# EAGLE design GROUP_09 (EAGLE 9.6.2)
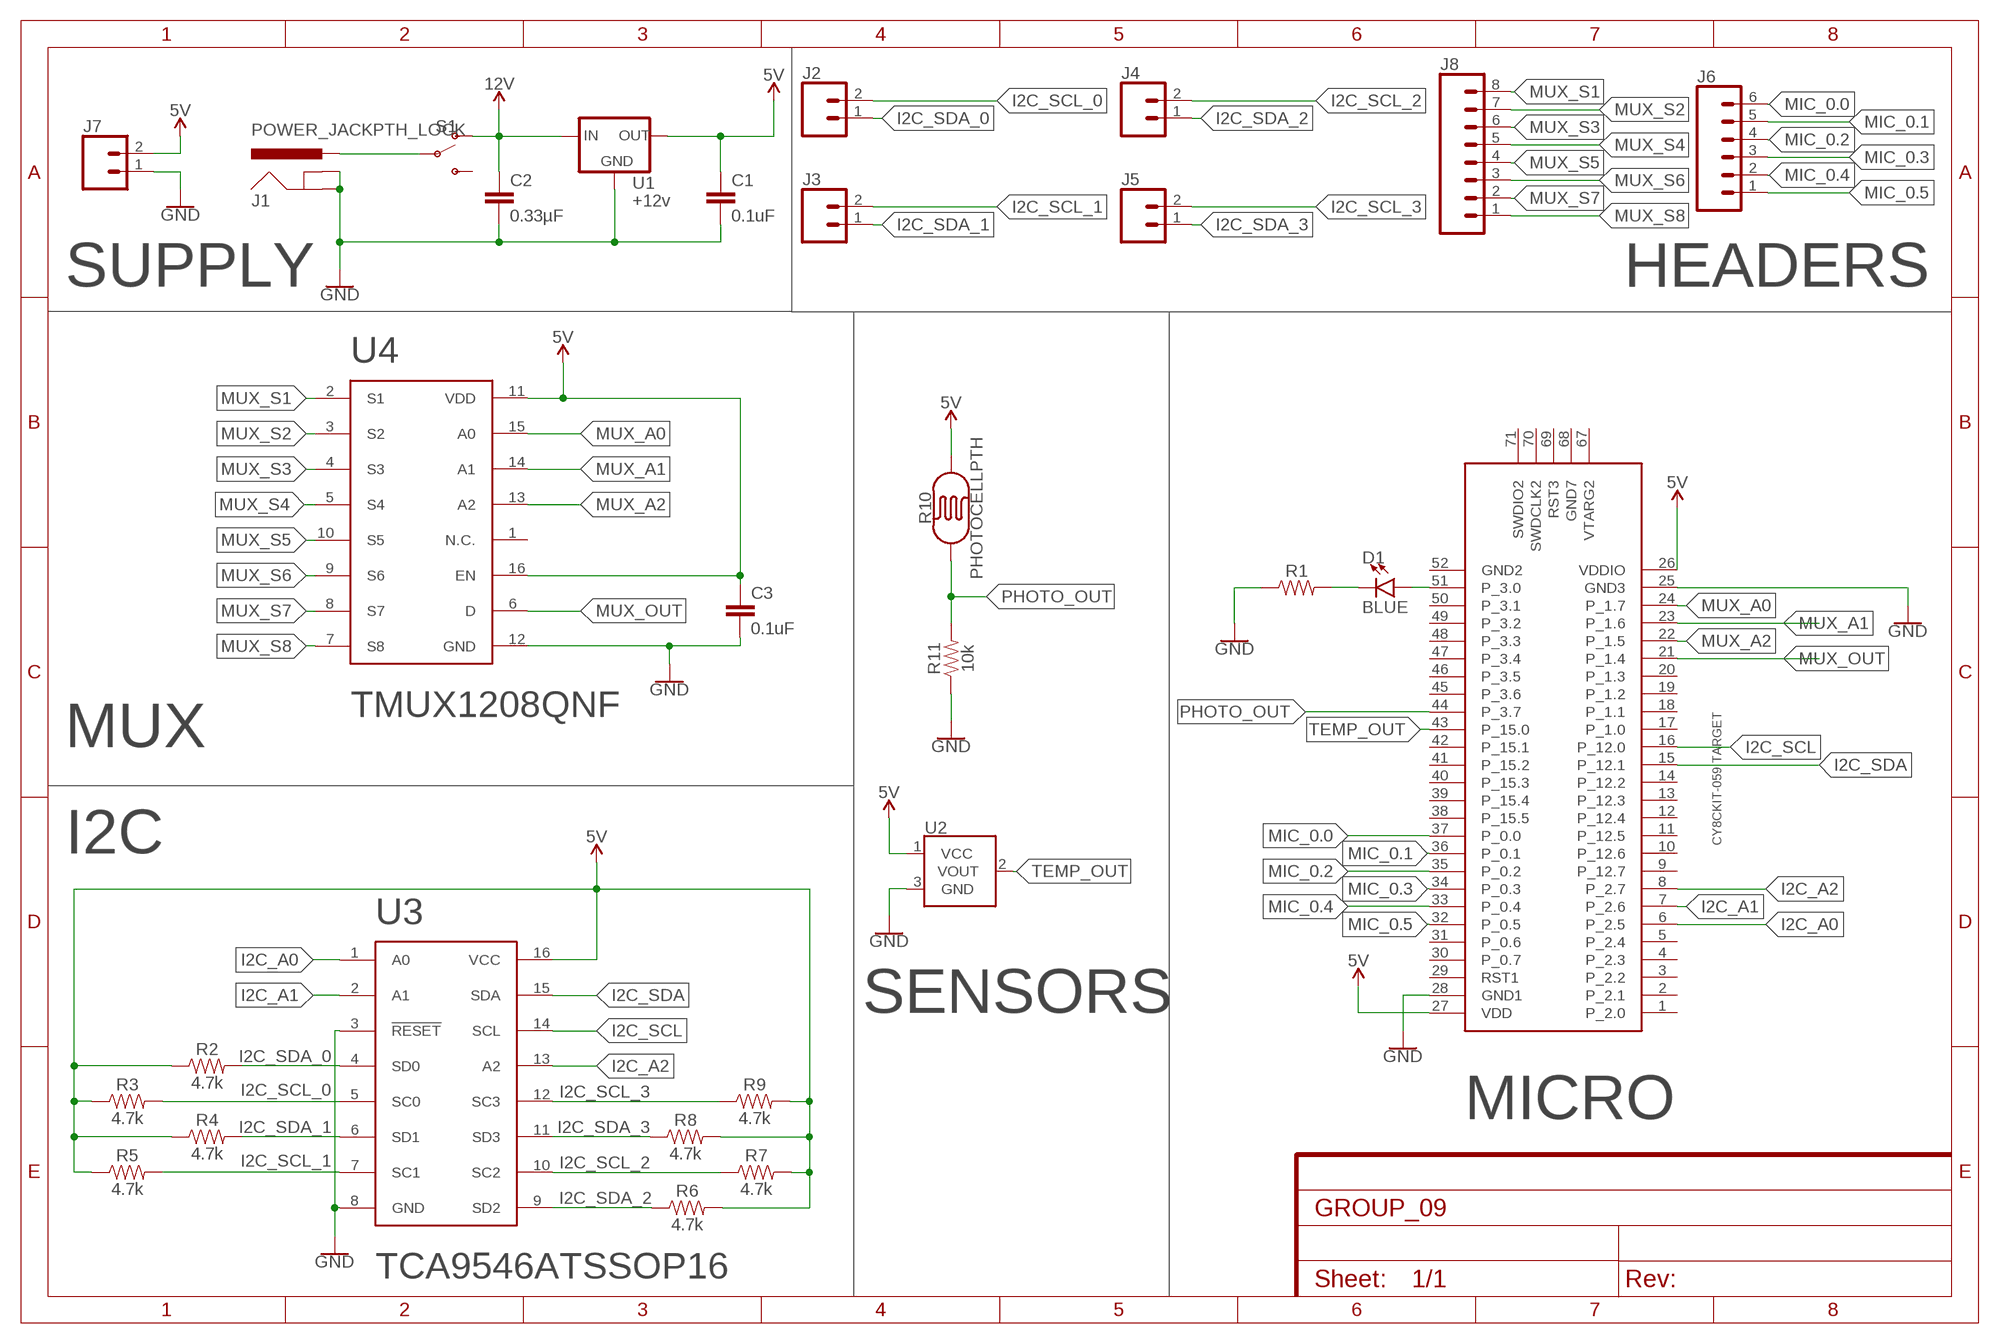
[diagram p0: schematic, sheet 1]

## Parts
C1  0.1uF  0.1UF-KIT-EZ-50V-20%  [CAP-PTH-SMALL-KIT]
C2  0.33µF  0.33UF/330NF-0805-50V-10%  [0805]
C3  0.1uF  0.1UF-KIT-EZ-50V-20%  [CAP-PTH-SMALL-KIT]
CY8CKIT059-TARGET  CY8CKIT-059_TARGET  [CY8CKIT-059_TARGET]
D1  BLUE  LED-BLUE1206  [LED-1206]
J1  POWER_JACKPTH_LOCK  [POWER_JACK_PTH_LOCK]
J2  CONN_02  [1X02]
J3  CONN_02  [1X02]
J4  CONN_02  [1X02]
J5  CONN_02  [1X02]
J6  CONN_06LOCK  [1X06_LOCK]
J7  CONN_02  [1X02]
J8  CONN_08LOCK  [1X08_LOCK]
R1  RESISTORAXIAL-0.3  [AXIAL-0.3]
R2  4.7k  4.7KOHM-0603-1/10W-1%  [0603]
R3  4.7k  4.7KOHM-0603-1/10W-1%  [0603]
R4  4.7k  4.7KOHM-0603-1/10W-1%  [0603]
R5  4.7k  4.7KOHM-0603-1/10W-1%  [0603]
R6  4.7k  4.7KOHM-0603-1/10W-1%  [0603]
R7  4.7k  4.7KOHM-0603-1/10W-1%  [0603]
R8  4.7k  4.7KOHM-0603-1/10W-1%  [0603]
R9  4.7k  4.7KOHM-0603-1/10W-1%  [0603]
R10  PHOTOCELLPTH  [PHOTOCELL]
R11  10k  10KOHM-0603-1/10W-1%  [0603]
S1  SWITCH-SPDT-PTH-11.6X4.0MM  [SWITCH_SPDT_PTH_11.6X4.0MM]
U1  +12v  V_REG_78XX7812  [TO-252]
U2  TMP36GT9  [TO-92]
U3  TCA9546ATSSOP16  [TSSOP-16]
U4  TMUX1208QNF  [QFN-16]

## Nets
5V: C1.1 C3.1 CY8CKIT059-TARGET.26(VDDIO) CY8CKIT059-TARGET.27(VDD) J7.2 R2.1 R3.1 R4.1 R5.1 R6.2 R7.2 R8.2 R9.2 R10.2 U1.2(OUT) U2.1(VCC) U3.16(VCC) U4.11(VDD) U4.16(EN)
12V: C2.1 S1.1(O) U1.1(IN)
GND: C1.2 C2.2 C3.2 CY8CKIT059-TARGET.25(GND3) CY8CKIT059-TARGET.28(GND1) J1.GND J1.GNDBREAK J7.1 R1.P$1 R11.1 U1.3(GND) U2.3(GND) U3.3(!RESET!) U3.8(GND) U4.12(GND)
I2C_A0: CY8CKIT059-TARGET.6(P_2.5) U3.1(A0)
I2C_A1: CY8CKIT059-TARGET.7(P_2.6) U3.2(A1)
I2C_A2: CY8CKIT059-TARGET.8(P_2.7) U3.13(A2)
I2C_SCL: CY8CKIT059-TARGET.16(P_12.0) U3.14(SCL)
I2C_SCL_0: J2.2 R3.2 U3.5(SC0)
I2C_SCL_1: J3.2 R5.2 U3.7(SC1)
I2C_SCL_2: J4.2 R7.1 U3.10(SC2)
I2C_SCL_3: J5.2 R9.1 U3.12(SC3)
I2C_SDA: CY8CKIT059-TARGET.15(P_12.1) U3.15(SDA)
I2C_SDA_0: J2.1 R2.2 U3.4(SD0)
I2C_SDA_1: J3.1 R4.2 U3.6(SD1)
I2C_SDA_2: J4.1 R6.1 U3.9(SD2)
I2C_SDA_3: J5.1 R8.1 U3.11(SD3)
MIC_0.0: CY8CKIT059-TARGET.37(P_0.0) J6.6
MIC_0.1: CY8CKIT059-TARGET.36(P_0.1) J6.5
MIC_0.2: CY8CKIT059-TARGET.35(P_0.2) J6.4
MIC_0.3: CY8CKIT059-TARGET.34(P_0.3) J6.3
MIC_0.4: CY8CKIT059-TARGET.33(P_0.4) J6.2
MIC_0.5: CY8CKIT059-TARGET.32(P_0.5) J6.1
MUX_A0: CY8CKIT059-TARGET.24(P_1.7) U4.15(A0)
MUX_A1: CY8CKIT059-TARGET.23(P_1.6) U4.14(A1)
MUX_A2: CY8CKIT059-TARGET.22(P_1.5) U4.13(A2)
MUX_OUT: CY8CKIT059-TARGET.21(P_1.4) U4.6(D)
MUX_S1: J8.8 U4.2(S1)
MUX_S2: J8.7 U4.3(S2)
MUX_S3: J8.6 U4.4(S3)
MUX_S4: J8.5 U4.5(S4)
MUX_S5: J8.4 U4.10(S5)
MUX_S6: J8.3 U4.9(S6)
MUX_S7: J8.2 U4.8(S7)
MUX_S8: J8.1 U4.7(S8)
N$2: J1.PWR S1.2(P)
N$6: CY8CKIT059-TARGET.51(P_3.0) D1.A
N$11: D1.C R1.P$2
PHOTO_OUT: CY8CKIT059-TARGET.44(P_3.7) R10.1 R11.2
TEMP_OUT: CY8CKIT059-TARGET.43(P_15.0) U2.2(VOUT)
Unconnected: CY8CKIT059-TARGET.1(P_2.0) CY8CKIT059-TARGET.2(P_2.1) CY8CKIT059-TARGET.3(P_2.2) CY8CKIT059-TARGET.4(P_2.3) CY8CKIT059-TARGET.5(P_2.4) CY8CKIT059-TARGET.9(P_12.7) CY8CKIT059-TARGET.10(P_12.6) CY8CKIT059-TARGET.11(P_12.5) CY8CKIT059-TARGET.12(P_12.4) CY8CKIT059-TARGET.13(P_12.3) CY8CKIT059-TARGET.14(P_12.2) CY8CKIT059-TARGET.17(P_1.0) CY8CKIT059-TARGET.18(P_1.1) CY8CKIT059-TARGET.19(P_1.2) CY8CKIT059-TARGET.20(P_1.3) CY8CKIT059-TARGET.29(RST1) CY8CKIT059-TARGET.30(P_0.7) CY8CKIT059-TARGET.31(P_0.6) CY8CKIT059-TARGET.38(P_15.5) CY8CKIT059-TARGET.39(P_15.4) CY8CKIT059-TARGET.40(P_15.3) CY8CKIT059-TARGET.41(P_15.2) CY8CKIT059-TARGET.42(P_15.1) CY8CKIT059-TARGET.45(P_3.6) CY8CKIT059-TARGET.46(P_3.5) CY8CKIT059-TARGET.47(P_3.4) CY8CKIT059-TARGET.48(P_3.3) CY8CKIT059-TARGET.49(P_3.2) CY8CKIT059-TARGET.50(P_3.1) CY8CKIT059-TARGET.52(GND2) CY8CKIT059-TARGET.67(VTARG2) CY8CKIT059-TARGET.68(GND7) CY8CKIT059-TARGET.69(RST3) CY8CKIT059-TARGET.70(SWDCLK2) CY8CKIT059-TARGET.71(SWDIO2) S1.3(S) U4.1(N.C.)

## Notes on the sheet
- SUPPLY | HEADERS
- MUX
- I2C
- SENSORS
- MICRO

## Library data of the parts
C1 C3 = SparkFun-Capacitors:0.1UF: 0.1µF ceramic capacitors A capacitor is a passive two-terminal electrical component used to store electrical energy temporarily in an electric field.; PROD_ID: CAP-08370
C2 = SparkFun-Capacitors:0.33UF/330NF: 0.33µF/330nF ceramic capacitors A capacitor is a passive two-terminal electrical component used to store electrical energy temporarily in an electric field.; PROD_ID: CAP-08469
CY8CKIT059-TARGET = CY8KIT-059:CY8CKIT-059_TARGET: CY8CKIT-059 Target This device exposes the pins of the target section of the CY8CKIT-059, including the programming section, that must be connected to the KitProg in order to program the target micro-controller.
D1 = SparkFun-LED:LED-BLUE: Blue SMD LED Used in manufacturing of various products at SparkFun Packages: 0603 - SMD 0603 package [Product Link] <http://www.digikey.com/product-detail/en/SMLE12BC7TT86/511-1589-2-ND/1641808> 1206 - SMD1206 package [Product Link] <http://www.digikey.com/product-detail/en/lite-on-inc/LTST-C150TBKT/160-1643-1-ND/573584> SparkFun Products: ESP8266 Thing-Dev Board <https://www.sparkfun.com/products/13711> RedBoard <https://www.sparkfun.com/products/12757>; PROD_ID: DIO-09911
J1 = SparkFun-Connectors:POWER_JACK: Power Jack Connector This is the standard 5.5mm barrel jack for power. The PTH is the most common, proven, reliable, footprint. The Slot footprint only works if the mill layer is transmitted to the PCB fab house so be warned. Here are the connectors we sell at SparkFun: DC Barrel Power Jack/Connector <https://www.sparkfun.com/products/119> (PRT-00119) DC Barrel Power Jack/Connector (SMD) <https://www.sparkfun.com/products/12748> (PRT-12748) DC Barrel Jack Adapter - Breadboard Compatible <https://www.sparkfun.com/products/10811> (PRT-10811) It is used on this SparkFun product (and many, many others): SparkFun RedBoard - Programmed with Arduino <https://www.sparkfun.com/products/12757> (DEV-12757) Also, if you need a mating power supply or connector, please check these out: Wall Adapter Power Supply - 9VDC 650mA <https://www.sparkfun.com/products/298> (TOL-00298) DC Barrel Jack Adapter - Male <https://www.sparkfun.com/products/10287> (PRT-10287); PROD_ID: CONN-08197; SF_ID: PRT-00119
J2-J5 J7 = SparkFun-Connectors:CONN_02: Multi connection point. Often used as Generic Header-pin footprint for 0.1 inch spaced/style header connections On any of the 0.1 inch spaced packages, you can populate with these: Break Away Headers - Straight <https://www.sparkfun.com/products/116> (PRT-00116) Break Away Male Headers - Right Angle <https://www.sparkfun.com/products/553> (PRT-00553) Female Headers <https://www.sparkfun.com/products/115> (PRT-00115) Break Away Headers - Machine Pin <https://www.sparkfun.com/products/117> (PRT-00117) Break Away Female Headers - Swiss Machine Pin <https://www.sparkfun.com/products/743> (PRT-00743) For SCREWTERMINALS and SPRING TERMINALS visit here: Screw Terimnals on SparkFun.com <https://www.sparkfun.com/search/results?term=Screw+Terminals> (5mm/3.5mm/2.54mm spacing) This device is also useful as a general connection point to wire up your design to another part of your project. Our various solder wires solder well into these plated through hole pads. Hook-Up Wire - Assortment (Stranded, 22 AWG) <https://www.sparkfun.com/products/11375> (PRT-11375) Hook-Up Wire - Assortment (Solid Core, 22 AWG) <https://www.sparkfun.com/products/11367> (PRT-11367) View the entire wire category on our website here <https://www.sparkfun.com/categories/141> Special notes: Molex polarized connector foot print use with: PRT-08233 with associated crimp pins and housings. 2.54_SCREWTERM for use with PRT-10571. 3.5mm Screw Terminal footprints for PRT-08084 5mm Screw Terminal footprints for use with PRT-08432
J6 = SparkFun-Connectors:CONN_06: Multi connection point. Often used as Generic Header-pin footprint for 0.1 inch spaced/style header connections On any of the 0.1 inch spaced packages, you can populate with these: Break Away Headers - Straight <https://www.sparkfun.com/products/116> (PRT-00116) Break Away Male Headers - Right Angle <https://www.sparkfun.com/products/553> (PRT-00553) Female Headers <https://www.sparkfun.com/products/115> (PRT-00115) Break Away Headers - Machine Pin <https://www.sparkfun.com/products/117> (PRT-00117) Break Away Female Headers - Swiss Machine Pin <https://www.sparkfun.com/products/743> (PRT-00743) Arduino Stackable Header - 6 Pin <https://www.sparkfun.com/products/9280> (PRT-09280) For SCREWTERMINALS and SPRING TERMINALS visit here: Screw Terimnals on SparkFun.com <https://www.sparkfun.com/search/results?term=Screw+Terminals> (5mm/3.5mm/2.54mm spacing) This device is also useful as a general connection point to wire up your design to another part of your project. Our various solder wires solder well into these plated through hole pads. Hook-Up Wire - Assortment (Stranded, 22 AWG) <https://www.sparkfun.com/products/11375> (PRT-11375) Hook-Up Wire - Assortment (Solid Core, 22 AWG) <https://www.sparkfun.com/products/11367> (PRT-11367) View the entire wire category on our website here <https://www.sparkfun.com/categories/141>
J8 = SparkFun-Connectors:CONN_08: Multi connection point. Often used as Generic Header-pin footprint for 0.1 inch spaced/style header connections On any of the 0.1 inch spaced packages, you can populate with these: Break Away Headers - Straight <https://www.sparkfun.com/products/116> (PRT-00116) Break Away Male Headers - Right Angle <https://www.sparkfun.com/products/553> (PRT-00553) Female Headers <https://www.sparkfun.com/products/115> (PRT-00115) Break Away Headers - Machine Pin <https://www.sparkfun.com/products/117> (PRT-00117) Break Away Female Headers - Swiss Machine Pin <https://www.sparkfun.com/products/743> (PRT-00743) Arduino Stackable Header - 8 Pin <https://www.sparkfun.com/products/9279> (PRT-09279) For SCREWTERMINALS and SPRING TERMINALS visit here: Screw Terimnals on SparkFun.com <https://www.sparkfun.com/search/results?term=Screw+Terminals> (5mm/3.5mm/2.54mm spacing) This device is also useful as a general connection point to wire up your design to another part of your project. Our various solder wires solder well into these plated through hole pads. Hook-Up Wire - Assortment (Stranded, 22 AWG) <https://www.sparkfun.com/products/11375> (PRT-11375) Hook-Up Wire - Assortment (Solid Core, 22 AWG) <https://www.sparkfun.com/products/11367> (PRT-11367) View the entire wire category on our website here <https://www.sparkfun.com/categories/141> Special notes: Molex polarized connector foot print use with SKU : PRT-08231 with associated crimp pins and housings. 1MM SMD Version SKU: PRT-10208 NOTES ON THE VARIANTS LOCK and LOCK_LONGPADS... This footprint was designed to help hold the alignment of a through-hole component (i.e. 6-pin header) while soldering it into place. You may notice that each hole has been shifted either up or down by 0.005 of an inch from it's more standard position (which is a perfectly straight line). This slight alteration caused the pins (the squares in the middle) to touch the edges of the holes. Because they are alternating, it causes a "brace" to hold the component in place. 0.005 has proven to be the perfect amount of "off-center" position when using our standard breakaway headers. Although looks a little odd when you look at the bare footprint, once you have a header in there, the alteration is very hard to notice. Also,if you push a header all the way into place, it is covered up entirely on the bottom side.
R1 = SparkFun-Resistors:RESISTOR: Generic Resistor Package
R2-R9 = SparkFun-Resistors:4.7KOHM: 4.7kΩ resistor A resistor is a passive two-terminal electrical component that implements electrical resistance as a circuit element. Resistors act to reduce current flow, and, at the same time, act to lower voltage levels within circuits. - Wikipedia; PROD_ID: RES-07857
R10 = SparkFun-Sensors:PHOTOCELL: Photocell (Photodetector, Photo Resistor, CdS) This is a very small light sensor. A photocell changes (also called a photodetector, photo resistor, CdS or photoconductive cell) resistance depending on the amount of light it is exposed to. These little sensors make great ambient light triggers (when light in the room turns on, do something). Datasheet <http://cdn.sparkfun.com/datasheets/Sensors/LightImaging/SEN-09088.pdf> SparkFun Products Mini Photocell <https://www.sparkfun.com/products/9088> (SEN-09088); PROD_ID: COMP-09129; SF_ID: SEN-09088
R11 = SparkFun-Resistors:10KOHM: 10kΩ resistor A resistor is a passive two-terminal electrical component that implements electrical resistance as a circuit element. Resistors act to reduce current flow, and, at the same time, act to lower voltage levels within circuits. - Wikipedia; PROD_ID: RES-00824
S1 = SparkFun-Switches:SWITCH-SPDT: Single Pole, Double Throw (SPDT) Switch Single-pole, double-throw (SPDT) switch. Variant Overview SMD-AYZ0202 Surface Mount DPDT Switch <https://www.sparkfun.com/products/597> (COM-00597) Used on e.g. LilyPad Arduino USB - ATmega32U4 Board <https://www.sparkfun.com/products/12049> PTH-11.6X4.0MM SPDT Mini Power Switch <https://www.sparkfun.com/products/102> (COM-00102) Used on e.g. SparkFun Simon Says - Through-Hole Soldering Kit <https://www.sparkfun.com/products/10547> (KIT-10547) PTH-11.6X4.0MM-KIT KIT version of SPDT Mini Power Switch - Simplifies soldering by removing tStop of switch pins - only one side can be soldered. PTH-11.6X4.0MM-LOCK LOCK version of SPDT Mini Power Switch - Offset pins hold switch in place for easier soldering. SMD-RIGHT-ANGLE Surface Mount Right Angle Switch <https://www.sparkfun.com/products/10860> (COM-10860) Used on e.g. SparkFun ESP8266 Thing <https://www.sparkfun.com/products/13231>; PROD_ID: SWCH-08261; SF_SKU: COM-00102
U1 = SparkFun-IC-Power:V_REG_78XX: Voltage Regulator Standard 78xx regulator. IGO (Input Ground Output). Spark Fun Electronics SKU : COM-00107; PROD_ID: VREG-12370
U2 = SparkFun-Sensors:TMP36: TMP36 Precision Analog °C Temperature Sensor The TMP36 is a low voltage, precision centigrade temperature sensor. It provides a voltage output that is linearly proportional to the Celsius temperature. It also doesn’t require any external calibration to provide typical accuracies of ±1°C at +25°C and ±2°C over the −40°C to +125°C temperature range. We like it because it’s so easy to use: Just give the device a ground and 2.7 to 5.5 VDC and read the voltage on the Vout pin. The output voltage can be converted to temperature easily using the scale factor of 10 mV/°C. Datasheet <http://cdn.sparkfun.com/datasheets/Sensors/Temp/TMP35_36_37.pdf> SparkFun Products Temperature Sensor - TMP36 <https://www.sparkfun.com/products/10988> (SEN-10988) SparkFun Danger Shield <https://www.sparkfun.com/products/11649> (DEV-11649); PROD_ID: IC-09880; SF_ID: SEN-10988
U3 = Group_09_Library:TCA9546A: TCA9546A The TCA9546A is a quad bidirectional translating switch controlled via the I2C bus. The SCL/SDA upstream pair fans out to four downstream pairs, or channels. Any individual SCn/SDn channel or combination of channels can be selected, determined by the contents of the programmable control register. An active-low reset (RESET) input allows the TCA9546A to recover from a situation in which one of the downstream I2C buses is stuck in a low state. Pulling RESET low resets the I2C state machine and causes all the channels to be deselected, as does the internal power-on reset function. Available packages: TCA9546A
U4 = Group_09_Library:TMUX1208: TMUX1208 The TMUX1208 is a general purpose complementary metal-oxide semiconductor (CMOS) multiplexer (MUX). The TMUX1208 offers 8:1 single ended channels. Wide operating supply of 1.08 V to 5.5 V allows for use in a broad array of applications from personal electronics to building automation applications. The device supports bidirectional analog and digital signals on the source (Sx) and drain (D) pins ranging from GND to VDD. All logic inputs have 1.8 V logic compatible thresholds, ensuring both TTL and CMOS logic compatibility when operating in the valid supply voltage range. Fail-Safe Logic circuitry allows voltages on the control pins to be applied before the supply pin, protecting the device from potential damage. Available packages: QFN(16)

## Board
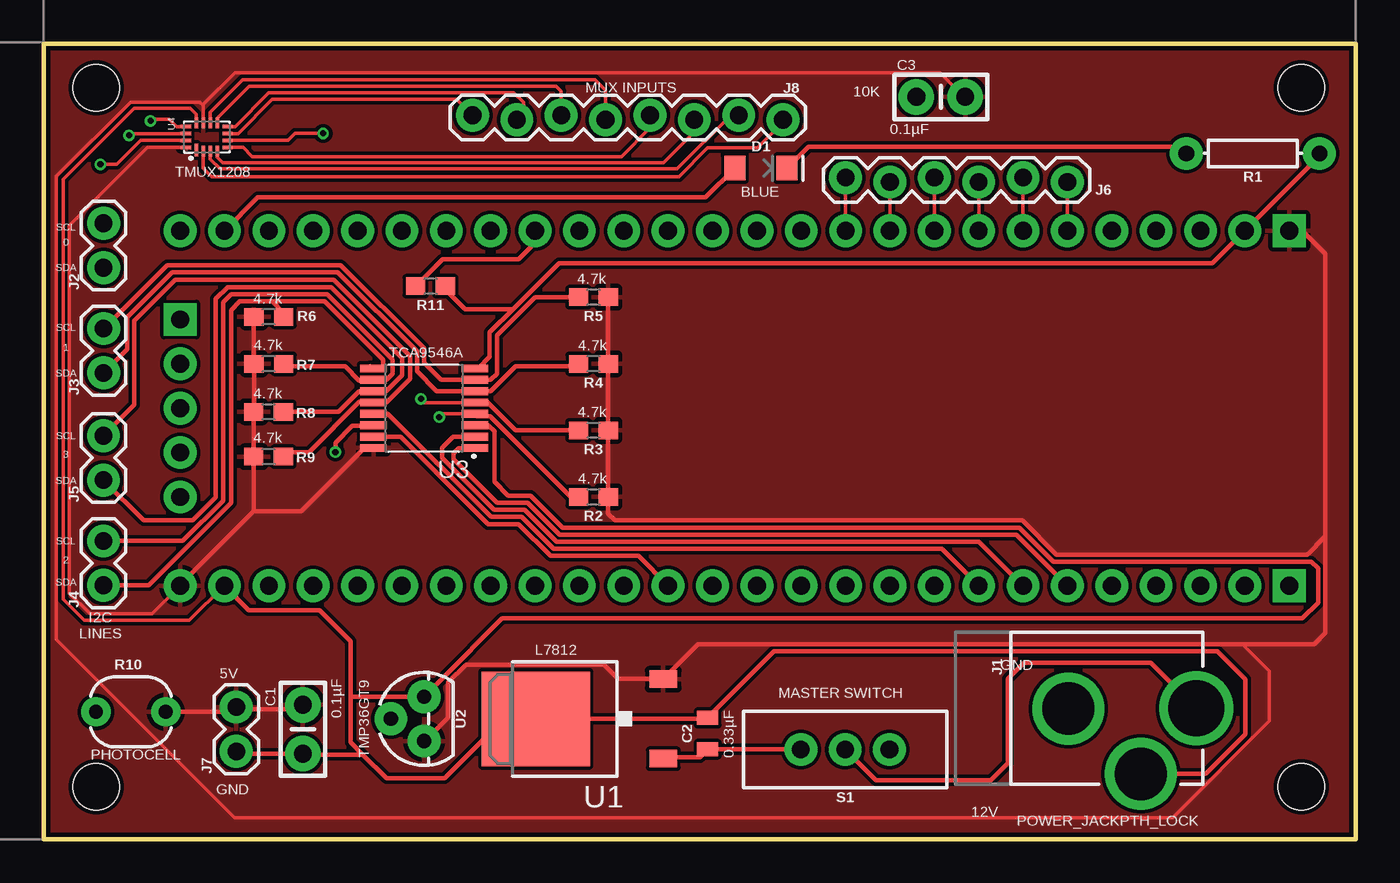
[diagram p1: board, top side]
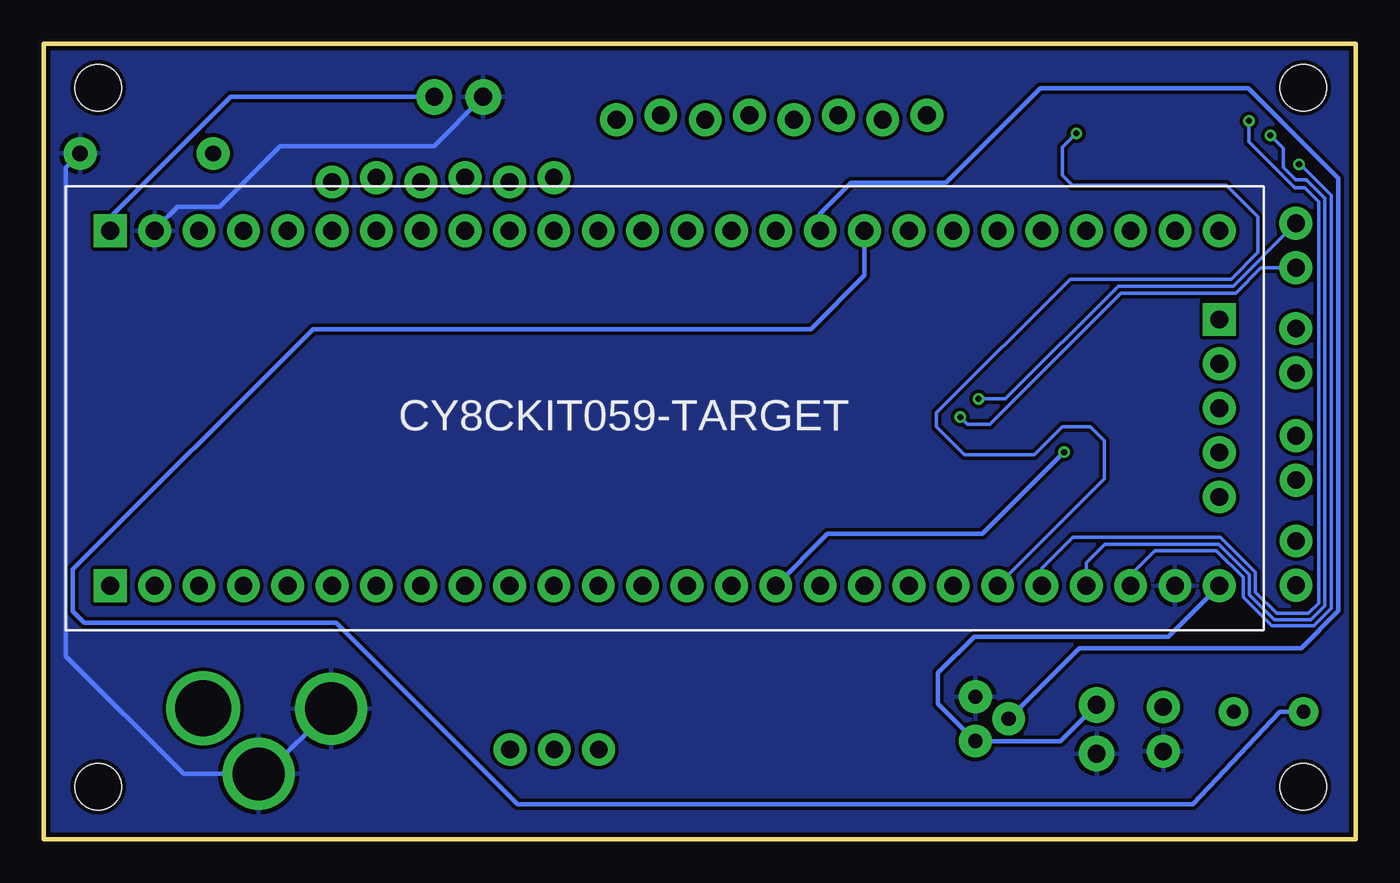
[diagram p2: board, bottom side, seen from below]

Size 75.12 x 45.53 mm. Coordinates in mm from the lower left corner, seen from the top.
Outline: 0,0 75.12,0 75.12,45.53 0,45.53 0,0
Copper layers (1*16): Top 0.035mm / dielectric 1.5mm / Bottom 0.035mm
Design rules "default *": minimum track width 6mil, minimum drill 8mil, track to track 6mil, track to pad 6mil, pad to pad 6mil, via to via 6mil, smd to smd 6mil, copper to edge 10mil, drill to drill 6mil, minimum pad ring 8mil, minimum via ring 6mil, stop-mask expansion 8mil, vias tented up to drill 0mil, thermal gap 10mil
Holes 2.65 mm at 3,43 3,3 72,43 72,3

### Footprints (pad centres in the part's own frame; a part is rotated, then mirrored left to right if it is on the bottom)
CAP-PTH-SMALL-KIT = drill 1.016 pad 2.032: 1 -1.397,0; 2 1.397,0
0805 = smd 0.8 x 1.2: 1 -0.9,0; 2 0.9,0
CY8CKIT-059_TARGET = drill 1.016 pad 1.876 square: 1 30.48,8.89; 27 30.48,-11.43; 71 -33.02,-6.35 | drill 1.016 pad 1.876: 2 27.94,8.89; 3 25.4,8.89; 4 22.86,8.89; 5 20.32,8.89; 6 17.78,8.89; 7 15.24,8.89; 8 12.7,8.89; 9 10.16,8.89; 10 7.62,8.89; 11 5.08,8.89; 12 2.54,8.89; 13 0,8.89; 14 -2.54,8.89; 15 -5.08,8.89; 16 -7.62,8.89; 17 -10.16,8.89; 18 -12.7,8.89; 19 -15.24,8.89; 20 -17.78,8.89; 21 -20.32,8.89; 22 -22.86,8.89; 23 -25.4,8.89; 24 -27.94,8.89; 25 -30.48,8.89; 26 -33.02,8.89; 28 27.94,-11.43; 29 25.4,-11.43; 30 22.86,-11.43; 31 20.32,-11.43; 32 17.78,-11.43; 33 15.24,-11.43; 34 12.7,-11.43; 35 10.16,-11.43; 36 7.62,-11.43; 37 5.08,-11.43; 38 2.54,-11.43; 39 0,-11.43; 40 -2.54,-11.43; 41 -5.08,-11.43; 42 -7.62,-11.43; 43 -10.16,-11.43; 44 -12.7,-11.43; 45 -15.24,-11.43; 46 -17.78,-11.43; 47 -20.32,-11.43; 48 -22.86,-11.43; 49 -25.4,-11.43; 50 -27.94,-11.43; 51 -30.48,-11.43; 52 -33.02,-11.43; 67 -33.02,3.81; 68 -33.02,1.27; 69 -33.02,-1.27; 70 -33.02,-3.81
LED-1206 = smd 1.2 x 1.4: A -1.5,0; C 1.5,0
POWER_JACK_PTH_LOCK = drill 2.997 pad 4.115: GND 0.025,6.557; GNDBREAK 3.762,10.7 | drill 3.2 pad 4.115: PWR 0,13.878
1X02 = drill 1.016 pad 1.88: 1 0,0; 2 2.54,0
1X06_LOCK = drill 1.016 pad 1.88: 1 0,0; 2 2.54,-0.254; 3 5.08,0; 4 7.62,-0.254; 5 10.16,0; 6 12.7,-0.254
1X08_LOCK = drill 1.016 pad 1.88: 1 0,0.127; 2 2.54,-0.127; 3 5.08,0.127; 4 7.62,-0.127; 5 10.16,0.127; 6 12.7,-0.127; 7 15.24,0.127; 8 17.78,-0.127
AXIAL-0.3 = drill 0.9 pad 1.88: P$1 -3.81,0; P$2 3.81,0
0603 = smd 1.1 x 1: 1 -0.85,0; 2 0.85,0
PHOTOCELL = drill 0.8 pad 1.676: 1 -2,0; 2 2,0
SWITCH_SPDT_PTH_11.6X4.0MM = drill 1.016 pad 1.88: 1 0,2.54; 2 0,0; 3 0,-2.54
TO-252 = smd 1 x 1.6: 1 -2.28,-4.8; 2 2.28,-4.8 | smd 5.4 x 6.2: 3 0,2.5
TO-92 = drill 0.813 pad 1.88: 1 -1.27,0; 2 0,1.905; 3 1.27,0
TSSOP-16 = smd 1.5 x 0.45: 1 -2.9,2.275; 2 -2.9,1.625; 3 -2.9,0.975; 4 -2.9,0.325; 5 -2.9,-0.325; 6 -2.9,-0.975; 7 -2.9,-1.625; 8 -2.9,-2.275; 9 2.9,-2.275; 10 2.9,-1.625; 11 2.9,-0.975; 12 2.9,-0.325; 13 2.9,0.325; 14 2.9,0.975; 15 2.9,1.625; 16 2.9,2.275
QFN-16 = smd 0.7 x 0.2: 1 -0.75,0.6 | smd 0.6 x 0.2: 2 -0.8,0.2; 3 -0.8,-0.2; 4 -0.8,-0.6; 9 0.8,-0.6; 10 0.8,-0.2; 11 0.8,0.2; 12 0.8,0.6 | smd 0.2 x 0.6: 5 -0.6,-1.2; 6 -0.2,-1.2; 7 0.2,-1.2; 8 0.6,-1.2; 13 0.6,1.2; 14 0.2,1.2; 15 -0.2,1.2; 16 -0.6,1.2

### Placement (x,y rotation side)
C1  14.84,6.3 270 top
C2  38.01,6.05 90 top
C3  51.36,42.49 180 top
CY8CKIT059-TARGET  40.83,23.4 180 bottom
D1  41.07,38.41 0 top
J1  52.11,7.5 270 top
J2  3.43,32.71 90 top
J3  3.43,26.69 90 top
J4  3.42,14.53 90 top
J5  3.42,20.55 90 top
J6  58.61,37.61 180 top
J7  11.03,5.03 90 top
J8  24.55,41.31 0 top
R1  69.23,39.25 180 top
R2  31.47,19.59 180 top
R3  31.47,23.4 180 top
R4  31.47,27.21 180 top
R5  31.47,31.02 180 top
R6  12.89,29.9 180 top
R7  12.89,27.21 180 top
R8  12.87,24.46 180 top
R9  12.87,21.9 180 top
R10  4.99,7.29 0 top
R11  22.14,31.65 180 top
S1  45.88,5.14 90 top
U1  30.67,6.89 90 top
U2  21.78,6.89 90 top
U3  21.78,24.67 180 top
U4  9.33,40.19 90 top

### Tracks (layer width: path | path; a pad name or v marks a point on that pad's centre or on a via)
5V
  Top 0.203: CY8CKIT059-TARGET.26 6.2,12.9 2.67,12.9 1.48,14.09 1.48,35.1 5.96,39.59 U4.16 | U4.11 9.13,42 | 9.13,42 9.13,42.05 10.95,43.87 51.3,43.87 52.69,42.49 C3.1 | 9.13,42 8.95,42.19 4.99,42.19 0.73,37.93 0.73,11.46 10.95,1.24 64.63,1.24 70.17,6.77 70.17,9.62 68.63,11.16 62.8,11.16
  Top 0.254: U2.1 21.93,5.72 23.15,6.94 23.15,8.97 24.17,9.99 32.08,9.99 32.89,9.18 35.34,9.18 U1.2 37.46,11.16 62.8,11.16 72.73,11.16 73.38,11.8 73.38,17.34 | 12.02,18.77 7.91,14.66 CY8CKIT059-TARGET.26 | CY8CKIT059-TARGET.27 72.05,34.83 73.38,33.5 73.38,17.34 | R6.2 R7.2 12.04,24.48 R8.2 12.16,24.46 12.02,24.32 R9.2 12.02,18.77 | 73.38,17.34 72.33,16.29 57.98,16.29 56.02,18.25 32.7,18.25 32.32,18.62 32.32,19.51 32.38,19.57 R2.1 R3.1 R4.1 R5.1 | 12.02,18.77 14.74,18.77 18.36,22.39 U3.16 | R10.2 10.76,7.29 10.89,7.43 | 10.89,7.43 J7.2 | C1.1 14.57,7.43 10.89,7.43
  Bottom 0.254: CY8CKIT059-TARGET.27 71.31,35.59 64.41,42.49 C3.1 | CY8CKIT059-TARGET.26 10.72,11.6 21.84,11.6 23.91,9.52 23.91,7.75 U2.1 16.91,5.62 C1.1
  pour Top (isolate 0.203): 0,45.6 75.2,45.6 75.2,0 0,0
12V
  Top 0.254: U1.1 35.55,4.71 37.56,4.71 C2.1 43.33,5.15 S1.1
GND
  Top 0.203: U4.12 8.73,41.5 8.4,41.83 5.17,41.83 1.11,37.77 1.11,13.75 2.32,12.53 8.34,12.53 10.32,14.51 CY8CKIT059-TARGET.25
  Top 0.254: CY8CKIT059-TARGET.25 11.75,13.11 15.79,13.11 17.56,11.34 17.56,8.16 | 17.56,8.16 17.56,5.54 18.27,4.84 | 17.56,8.16 U2.3 22.75,9.12 22.75,9.14 26.25,12.64 72.06,12.64 72.96,13.54 72.96,15.5 72.58,15.88 57.81,15.88 55.85,17.84 29.69,17.84 27.87,19.67 26.59,19.67 25.81,20.45 25.81,23.35 25.45,23.7 U3.3 | R1.P$1 73.04,39.1 CY8CKIT059-TARGET.28 66.92,32.98 29.51,32.98 26.87,30.33 | U3.8 24.88,26.95 25.54,27.6 25.54,29 26.87,30.33 | 18.27,4.84 19.62,3.49 22.95,3.49 26.2,6.74 28.03,6.74 U1.3 37.95,6.89 C2.2 41.81,10.76 67.2,10.76 68.8,9.16 68.8,6 66.54,3.74 J1.GNDBREAK | 26.87,30.33 24.13,30.33 22.99,31.47 R11.1 | J7.1 11.16,4.9 C1.2 14.9,4.84 18.27,4.84
  Bottom 0.254: CY8CKIT059-TARGET.28 68.67,34.98 67.45,36.2 65.04,36.2 61.57,39.67 52.78,39.67 C3.2 | R1.P$1 73.85,38.44 73.85,10.47 67.12,3.74 J1.GNDBREAK 62.4,3.74 J1.GND
  pour Bottom (isolate 0.203): 0,45.6 0,0 75.2,0 75.2,45.6
I2C_A0
  Top 0.254: 24.74,22.33 U3.1 24.67,22.38 23.76,22.38 23.46,22.08 23.46,21.75 25.95,19.26 27.7,19.26 29.53,17.43 55.69,17.43 CY8CKIT059-TARGET.6
I2C_A1
  Top 0.254: U3.2 23.45,23.05 22.8,22.4 22.8,21.83 25.78,18.85 27.53,18.85 29.36,17.03 53.55,17.03 CY8CKIT059-TARGET.7
I2C_A2
  Top 0.254: U3.13 19.7,24.35 25.61,18.45 27.36,18.45 29.19,16.62 51.42,16.62 CY8CKIT059-TARGET.8
I2C_SCL  (via drill 0.35)
  Top 0.254: U3.14 18.84,23.65 17.67,23.65 16.7,22.69 v16.7,22.16
  Bottom 0.254: v16.7,22.16 21.37,17.48 30.24,17.48 CY8CKIT059-TARGET.16
I2C_SCL_0  (via drill 0.35)
  Top 0.203: v21.6,25.2 21.8,25 U3.5
  Top 0.254: R3.2 27.01,23.4 25.39,25.03 24.78,25.03 U3.5
  Bottom 0.203: J2.2 7.02,31.66 13.6,31.66 20.05,25.2 v21.6,25.2
I2C_SCL_1
  Top 0.254: R5.2 28.13,31.02 25.95,28.84 25.95,26.65 25.59,26.3 U3.7 22.75,26.3 21.78,27.26 21.78,28.09 17.01,32.86 7.06,32.86 J3.2
I2C_SCL_2
  Top 0.254: R7.1 13.8,27.06 17.26,27.06 18.07,26.25 18.68,26.25 U3.10 19.62,26.3 19.98,26.66 19.98,27.45 16.24,31.19 10.74,31.19 10.28,30.73 10.28,19.38 7.96,17.07 J4.2
I2C_SCL_3
  Top 0.254: J5.2 5.19,24.86 5.19,29.69 7.52,32.02 16.61,32.02 20.97,27.66 20.97,26.36 19.6,25 U3.12 18.68,25.03 18.07,25.03 15.21,22.16 13.98,22.16 R9.1
I2C_SDA
  Top 0.254: 18.88,22.99 U3.15 20.43,23.05 25.44,18.04 27.19,18.04 29.02,16.21 34.05,16.21 CY8CKIT059-TARGET.15
I2C_SDA_0  (via drill 0.35)
  Top 0.203: v22.64,24.16 22.83,24.34 U3.4
  Top 0.254: 24.78,24.21 U3.4 24.83,24.2 25.55,24.2 30.16,19.59 R2.2
  Bottom 0.203: J2.1 5.43,32.71 6.88,31.25 13.46,31.25 20.96,23.76 22.24,23.76 v22.64,24.16
I2C_SDA_1
  Top 0.254: R4.2 30.45,27.06 27.01,27.06 25.59,25.64 24.78,25.64 U3.6 22.51,25.64 21.38,26.78 21.38,27.92 16.84,32.45 7.35,32.45 4.78,29.88 4.78,28.04 J3.1
I2C_SDA_2
  Top 0.254: U3.9 18.68,27.06 18.88,26.85 19.42,26.85 19.42,27.44 16.08,30.78 13.07,30.78 | 13.07,30.78 11.23,30.78 10.72,30.27 10.72,19.25 6,14.53 J4.1 | 13.07,30.78 13.73,30.11 R6.1
I2C_SDA_3
  Top 0.254: J5.1 5.73,18.24 8.53,18.24 9.86,19.57 9.86,30.93 10.53,31.6 16.45,31.6 20.51,27.54 20.51,26.55 19.6,25.64 U3.11 18.68,25.64 18.07,25.64 16.9,24.46 R8.1
MIC_0.0
  Top 0.203: J6.6 CY8CKIT059-TARGET.37
MIC_0.1
  Top 0.203: J6.5 CY8CKIT059-TARGET.36
MIC_0.2
  Top 0.203: J6.4 CY8CKIT059-TARGET.35
MIC_0.3
  Top 0.203: J6.3 CY8CKIT059-TARGET.34
MIC_0.4
  Top 0.203: J6.2 CY8CKIT059-TARGET.33
MIC_0.5
  Top 0.203: J6.1 CY8CKIT059-TARGET.32
MUX_A0  (via drill 0.35)
  Top 0.203: U4.15 5.56,39.99 4.19,38.63 v3.25,38.63
  Bottom 0.203: CY8CKIT059-TARGET.24 12.89,15.13 11.5,16.52 7.99,16.52 6.45,14.98 6.45,13.85 4.82,12.21 2.4,12.21 1.4,13.21 1.4,36.86 3.17,38.63 v3.25,38.63
MUX_A1  (via drill 0.35)
  Top 0.203: U4.14 5,40.39 v4.89,40.28
  Bottom 0.203: CY8CKIT059-TARGET.23 15.43,15.84 14.38,16.89 7.86,16.89 6.1,15.13 6.1,14 4.67,12.57 2.58,12.57 1.77,13.38 1.77,36.68 2.83,37.74 3.44,37.74 4.15,38.46 4.15,39.54 v4.89,40.28
MUX_A2  (via drill 0.35)
  Top 0.203: U4.13 7.61,40.79 7.2,41.2 6.21,41.2 v6.12,41.11
  Bottom 0.203: CY8CKIT059-TARGET.22 17.97,15.5 16.19,17.28 7.75,17.28 5.74,15.28 5.74,14.15 4.52,12.92 2.72,12.92 2.13,13.51 2.13,36.5 2.91,37.27 3.48,37.27 6.12,39.91 v6.12,41.11
MUX_OUT  (via drill 0.35)
  Top 0.203: U4.6 13.99,39.99 14.4,40.4 v16,40.4
  Bottom 0.203: v16,40.4 16.8,39.6 16.8,38 16.22,37.42 7.41,37.42 5.6,35.62 5.6,33.59 7.13,32.06 16.34,32.06 24,24.4 24,23.6 22.4,22 18.4,22 16.8,23.6 15.2,23.6 14.4,22.8 14.4,20.62 CY8CKIT059-TARGET.21
MUX_S1
  Top 0.203: U4.2 9.13,38.4 9.61,37.93 36.36,37.93 38.01,39.58 40.86,39.58 42.33,41.04 J8.8
MUX_S2
  Top 0.203: U4.3 9.53,38.92 10.1,38.36 36.27,38.36 39.34,41.43 J8.7
MUX_S3
  Top 0.203: U4.4 9.93,39.03 10.24,38.72 35.48,38.72 37.25,40.49 J8.6
MUX_S4
  Top 0.203: U4.5 11.42,39.59 11.94,39.07 33.07,39.07 34.71,40.71 J8.5
MUX_S5
  Top 0.203: U4.10 9.53,41.61 11.38,43.46 31.57,43.46 32.17,42.86 J8.4
MUX_S6
  Top 0.203: U4.9 9.93,41.26 11.76,43.09 29.34,43.09 29.63,42.8 J8.3
MUX_S7
  Top 0.203: J8.2 27.46,41.55 27.46,42.17 26.91,42.73 12.89,42.73 10.95,40.79 U4.8
MUX_S8
  Top 0.203: J8.1 23.63,42.35 13.08,42.35 11.12,40.39 U4.7
N$2
  Top 0.254: S1.2 47.64,3.38 54.23,3.38 55.2,4.35 55.2,9.2 56.12,10.12 63.37,10.12 J1.PWR
N$6
  Top 0.254: CY8CKIT059-TARGET.51 12.25,36.73 37.89,36.73 D1.A
N$11
  Top 0.254: R1.P$2 65.05,39.62 43.78,39.62 D1.C
PHOTO_OUT
  Top 0.254: CY8CKIT059-TARGET.44 28.13,34.13 27.2,33.2 22.84,33.2 R11.2
  Bottom 0.254: CY8CKIT059-TARGET.44 28.13,32.27 31.2,29.2 59.69,29.2 73.44,15.45 73.44,13.04 72.8,12.4 58.39,12.4 47.99,2 9.33,2 4.37,7.29 R10.1
TEMP_OUT
  Bottom 0.254: U2.2 15.82,10.94 3.12,10.94 1,13.07 1,37.82 6.16,42.97 18.06,42.97 23.46,37.57 28.89,37.57 30.67,35.8 CY8CKIT059-TARGET.43

### Text on the board
tPlace: C3 | MUX INPUTS | 10K | 0.1µF | TMUX1208 | BLUE | SCL | 0 | SDA | 4.7k | 4.7k | SCL | 4.7k | 4.7k | 1 | TCA9546A | SDA | 4.7k | 4.7k | SCL | 4.7k | 3 | 4.7k | SDA | SCL | 2 | SDA | I2C / LINES | L7812 | GND | 5V | C1 | MASTER SWITCH | 0.1µF | PHOTOCELL | TMP36GT9 | 0.33µF | GND | 12V | POWER_JACKPTH_LOCK
bPlace: CY8CKIT059-TARGET